# Altium schematic sheet CANbus.SchDoc
size A4
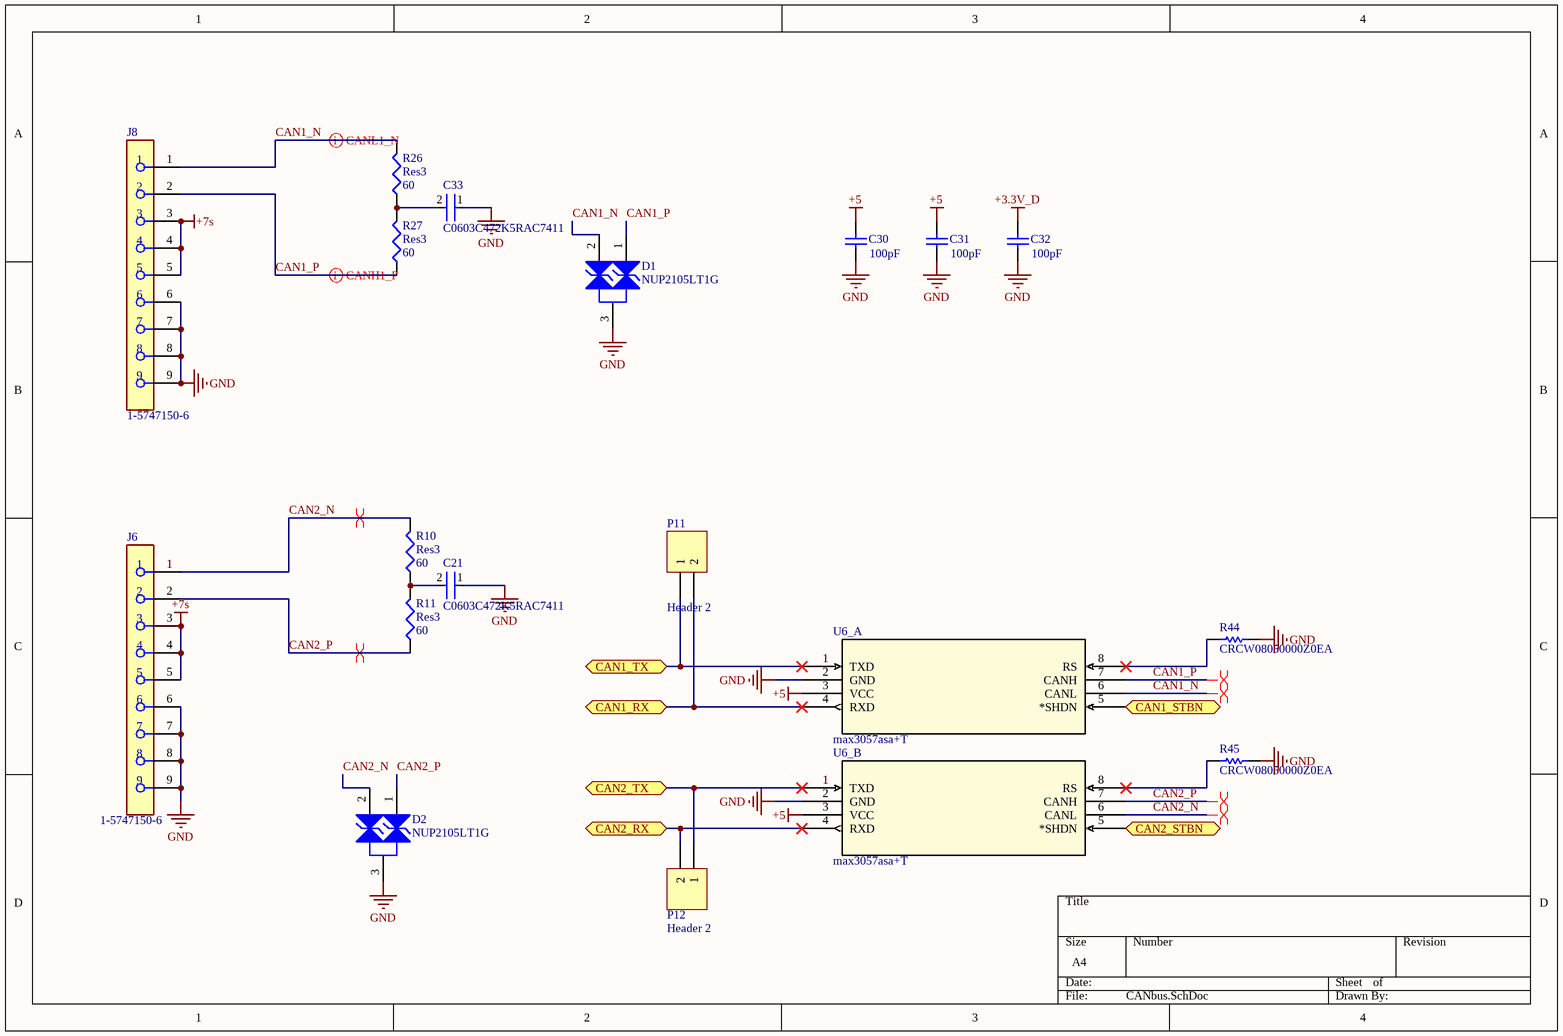
[diagram p0: CANbus.SchDoc]

## Parts
C21  C0603C472K5RAC7411  [FP-C0603C-CF-MFG]
C30  value 100pF  [CAPC1608X90X35NL10T15]  (hidden comment: GRM1885C1H101JA01D)
C31  value 100pF  [CAPC1608X90X35NL10T15]  (hidden comment: GRM1885C1H101JA01D)
C32  value 100pF  [CAPC1608X90X35NL10T15]  (hidden comment: GRM1885C1H101JA01D)
C33  C0603C472K5RAC7411  [FP-C0603C-CF-MFG]
D1  NUP2105LT1G  [ONSC-SOT-23-3-318-08_V]
D2  NUP2105LT1G  [ONSC-SOT-23-3-318-08_V]
J6  1-5747150-6  [FP-1-5747150-6-MFG]
J8  1-5747150-6  [FP-1-5747150-6-MFG]
P11  Header 2  [HDR1X2]
P12  Header 2  [HDR1X2]
R10  Res3  value 60  [J1-0603]
R11  Res3  value 60  [J1-0603]
R26  Res3  value 60  [J1-0603]
R27  Res3  value 60  [J1-0603]
R44  CRCW08050000Z0EA  [RESC2013X50X30LL20T20]
R45  CRCW08050000Z0EA  [RESC2013X50X30LL20T20]
U6_A  max3057asa+T  [21-0041B_8_MXM]
U6_B  max3057asa+T  [21-0041B_8_MXM]

## Ports
CAN1_RX (bidir), CAN1_STBN (bidir), CAN1_TX (bidir), CAN2_RX (bidir), CAN2_STBN (bidir), CAN2_TX (bidir)

## Nets
+3.3V_D: C32.2
+5: C30.2 C31.2 U6_A.3(VCC) U6_B.3(VCC)
+7s: J6.3 J6.4 J6.5 J8.3 J8.4 J8.5
GND: C21.1 C30.1 C31.1 C32.1 C33.1 D1.3(K) D2.3(K) J6.6 J6.7 J6.8 J6.9 J8.6 J8.7 J8.8 J8.9 R44.2 R45.2 U6_A.2(GND) U6_B.2(GND)
CAN1_N: D1.2(K) J8.1 R26.2 U6_A.6(CANL)
CAN1_P: D1.1(K) J8.2 R27.1 U6_A.7(CANH)
CAN1_RX: P11.2 U6_A.4(RXD) ; port CAN1_RX
CAN1_STBN: U6_A.5(*SHDN) ; port CAN1_STBN
CAN1_TX: P11.1 U6_A.1(TXD) ; port CAN1_TX
CAN2_N: D2.2(K) J6.1 R10.2 U6_B.6(CANL)
CAN2_P: D2.1(K) J6.2 R11.1 U6_B.7(CANH)
CAN2_RX: P12.2 U6_B.4(RXD) ; port CAN2_RX
CAN2_STBN: U6_B.5(*SHDN) ; port CAN2_STBN
CAN2_TX: P12.1 U6_B.1(TXD) ; port CAN2_TX
NetC21_2: C21.2 R10.1 R11.2
NetC33_2: C33.2 R26.1 R27.2
NetR44_1: R44.1 U6_A.8(RS)
NetR45_1: R45.1 U6_B.8(RS)

## Layout directives
differential pair: CAN1_N, CAN1_P, CAN2_N, CAN2_P

## Library data of the parts
C21 C33 = CMP-03020-003188-1: C0603 4,700 pF X7R 30ppm/°C 10.00% 50 V; Manufacturer: KEMET; Automotive Grade: Grade 1; Voltage Rating: 50 V; Material: Ceramic; Tolerance: 0.1; Capacitance: 4,700 pF; Manufacturer Part Number: C0603C472K5RAC7411; ComponentLink2URL: https://api.kemet.com/component-edge/download/datasheet/C0603C100J5GACAUTO.pdf; Value: 4,700 pF; RoHS: TRUE; Automotive: Yes; Package: C0603C-CF; Device Class L1: Passive Components; Temperature Coefficient: 30ppm/°C; Octopart: https://octopart.com/c0603c472k5rac7411-kemet-3746251; Temperature Range Low: -55°C; Height: 0.87mm; Device Class L2: Capacitors; Lead Free: Yes; ComponentLink2Description: Datasheet; Temperature: -55°C to +125°C; Temperature Range High: +125°C; Temperature Characteristic: X7R; Device Class L3: Ceramic Capacitors; Category: Cap
C30-C32 = CMP-2006-02595-1: Manufacturer: Murata; Part Number: GRM1885C1H101JA01D
D1 D2 = CMP-1063-00164-1: Dual Line CAN Bus Protector, 3-Pin SOT-23, Pb-Free, Tape and Reel; Manufacturer: On Semiconductor; IR Max (uA): 0.1; Number of Lines: 2; Direction: Bidirectional; C Max (pF): 30; PPK Max (W): 350; V(BR) Min (V): 26.2; ComponentLink3URL: http://www.onsemi.cn/pub_link/Collateral/318-08.PDF; Mounting Technology: Surface Mount; ComponentLink2Description: Datasheet; PartNumber: NUP2105LT1G; ComponentLink1URL: http://www.onsemi.com/; PackageVersion: Rev. AP, 11/2009; DatasheetVersion: Rev. 5; RoHS: Pb-Free; PackageReference: SOT-23-3-318-08; ComponentLink2URL: http://www.onsemi.cn/pub_link/Collateral/NUP2105L-D.PDF; ComponentLink1Description: Manufacturer URL; PackageDescription: 3-Pin Small Outline Transistor, Body 2.92 x 1.3 mm, Pitch 0.95 mm; Packing: Tape and Reel; ComponentLink3Description: Package Specification
J6 J8 = CMP-03367-000009-1: CONN D-SUB RCPT 9POS VERT SOLDER; Manufacturer: TE Connectivity; Is Female: yes; Current Rating: 6A; Conn Orientation: Vertical; Conn Gender: Female; Shielding: false; Number Of Contacts: 9; Pitch: 2.74mm; ComponentLink2URL: https://www.te.com/usa-en/product-1-5747150-6.html?te_bu=Cor&te_type=other&te_campaign=oct_glo_cor-oct-global-oth-prtnr-fy19-oct-octo-buy-bom_sma-298_2&elqCampaignId=35216; Manufacturer Part Number: 1-5747150-6; Temperature: -55°C to +105°C; Mouser Description: D-Sub Standard Connectors RECP FRNT MTL SHL 9P female screwlocks; Octopart: https://octopart.com/1-5747150-6-te+connectivity-39500344; Category: Conn; Automotive: No; Package: 1-5747150-6; Device Class L3: unset; Contact Material: Gold,Nickel; Lead Free: Yes; Height: 12.54mm; RoHS: TRUE; ComponentLink2Description: Datasheet; Device Class L2: D-Sub Connectors; Device Class L1: Connectors; Digikey Description: CONN D-SUB RCPT 9POS VERT SOLDER; Temperature Range High: +105°C; Temperature Range Low: -55°C
P11 P12 = Header 2: Header, 2-Pin; LatestRevisionDate: 17-Jul-2002; LatestRevisionNote: Re-released for DXP Platform.; Publisher: Altium Limited
R10 R11 R26 R27 = Res3: RESISTOR, 0603, 60R4 1%, 0.1W; Manufacturer: Panasonic; Manufacturer Part Number: ERJ-3EKF60R4V; Resistance: 60.4R; Power Rating: 100mW; Temperature Coefficient: 100ppm/°C; Voltage Rating: 75V; Voltage Rating (DC): 50V; Published: 8-Jun-2000; LatestRevisionDate: 29-May-2009; LatestRevisionNote: IPC-7351 Footprint Added.; PackageReference: J1-0603; Publisher: Altium Limited; PackageDescription: Chip Resistor; Supplier 1: Digi-Key; Supplier Part Number 1: P60.4HCT-ND; RoHS: Yes; Category: Chip SMD Resistors; Stock 1: 97677; Pricing 1: 1=0.10000, 10=0.05400, 100=0.02190, 1000=0.00983, 2500=0.00853 (USD); Mount: Surface Mount; Case/Package: 0603; Case Code (Metric): 1608; Case Code (Imperial): 0603; Contact Plating: Tin; Min Operating Temperature: -55°C; Max Operating Temperature: 155°C; Tolerance: 1%; Packaging: Tape and Reel; Composition: Thick Film; Number of Terminations: 2; Package Quantity: 1; Termination: SMD/SMT; Max Power Dissipation: 100mW; Military Standard: Not; Features: Automotive AEC-Q200; Length: 1.6mm; Height: 0.022inch; Width: 0.031inch; Depth: 0.8mm; REACH SVHC: No SVHC; Lead Free: Lead Free; ComponentLink1URL: https://datasheet.ciiva.com/28594/1678782-28594695.pdf?src-supplier=Element14; ComponentLink1Description: https://datasheet.ciiva.com/28594/1678782-28594695.pdf?src-supplier=Element14; ComponentLink2URL: https://datasheet.ciiva.com/30163/aoa0000ce2-30163208.pdf?src-supplier=Onlinecomponents.com; ComponentLink2Description: https://datasheet.ciiva.com/30163/aoa0000ce2-30163208.pdf?src-supplier=Onlinecomponents.com; ComponentLink3URL: https://datasheet.ciiva.com/5951/426256-5951371.pdf?src-supplier=Farnell; ComponentLink3Description: https://datasheet.ciiva.com/5951/426256-5951371.pdf?src-supplier=Farnell; ComponentLink4URL: https://datasheet.ciiva.com/16757/70260748-16757877.pdf?src-supplier=Allied+Electronics; ComponentLink4Description: https://datasheet.ciiva.com/16757/70260748-16757877.pdf?src-supplier=Allied+Electronics; ComponentLink5URL: https://datasheet.ciiva.com/24068/aoa0000ce2-24068761.pdf?src-supplier=Mouser; ComponentLink5Description: https://datasheet.ciiva.com/24068/aoa0000ce2-24068761.pdf?src-supplier=Mouser; ComponentLink6URL: https://datasheet.ciiva.com/16783/70260748-16783402.pdf?src-supplier=Allied+Electronics; ComponentLink6Description: https://datasheet.ciiva.com/16783/70260748-16783402.pdf?src-supplier=Allied+Electronics; ComponentLink7URL: https://datasheet.ciiva.com/28677/1678782-28677676.pdf?src-supplier=Element14; ComponentLink7Description: https://datasheet.ciiva.com/28677/1678782-28677676.pdf?src-supplier=Element14; ComponentLink8URL: https://datasheet.ciiva.com/43460/426256-43460428.pdf?src-supplier=Farnell; ComponentLink8Description: https://datasheet.ciiva.com/43460/426256-43460428.pdf?src-supplier=Farnell; ComponentLink9URL: https://datasheet.ciiva.com/46377/426256-46377437.pdf?src-supplier=Element14; ComponentLink9Description: https://datasheet.ciiva.com/46377/426256-46377437.pdf?src-supplier=Element14
R44 R45 = CMP-2001-04896-1: Manufacturer: Vishay Dale; Part Number: CRCW08050000Z0EA
U6_A U6_B = max3057asa+T: No Description Available; Mfr_Name: Maxim Integrated Products; Copyright: Copyright (C) 2022 Ultra Librarian. All rights reserved.; Manufacturer_Part_Number: max3057asa+T; Digi-Key_Part_Number_1: MAX3057ASA+CT-ND; Digi-Key_Part_Number_2: MAX3057ASA+DKR-ND; Digi-Key_Part_Number_3: MAX3057ASA+T-ND; Digi-Key_Part_Number_4: MAX3057ASA+TR-ND; RefDes: RefDes; Type: DEV